# Altium schematic sheet 手环.SchDoc
size A2
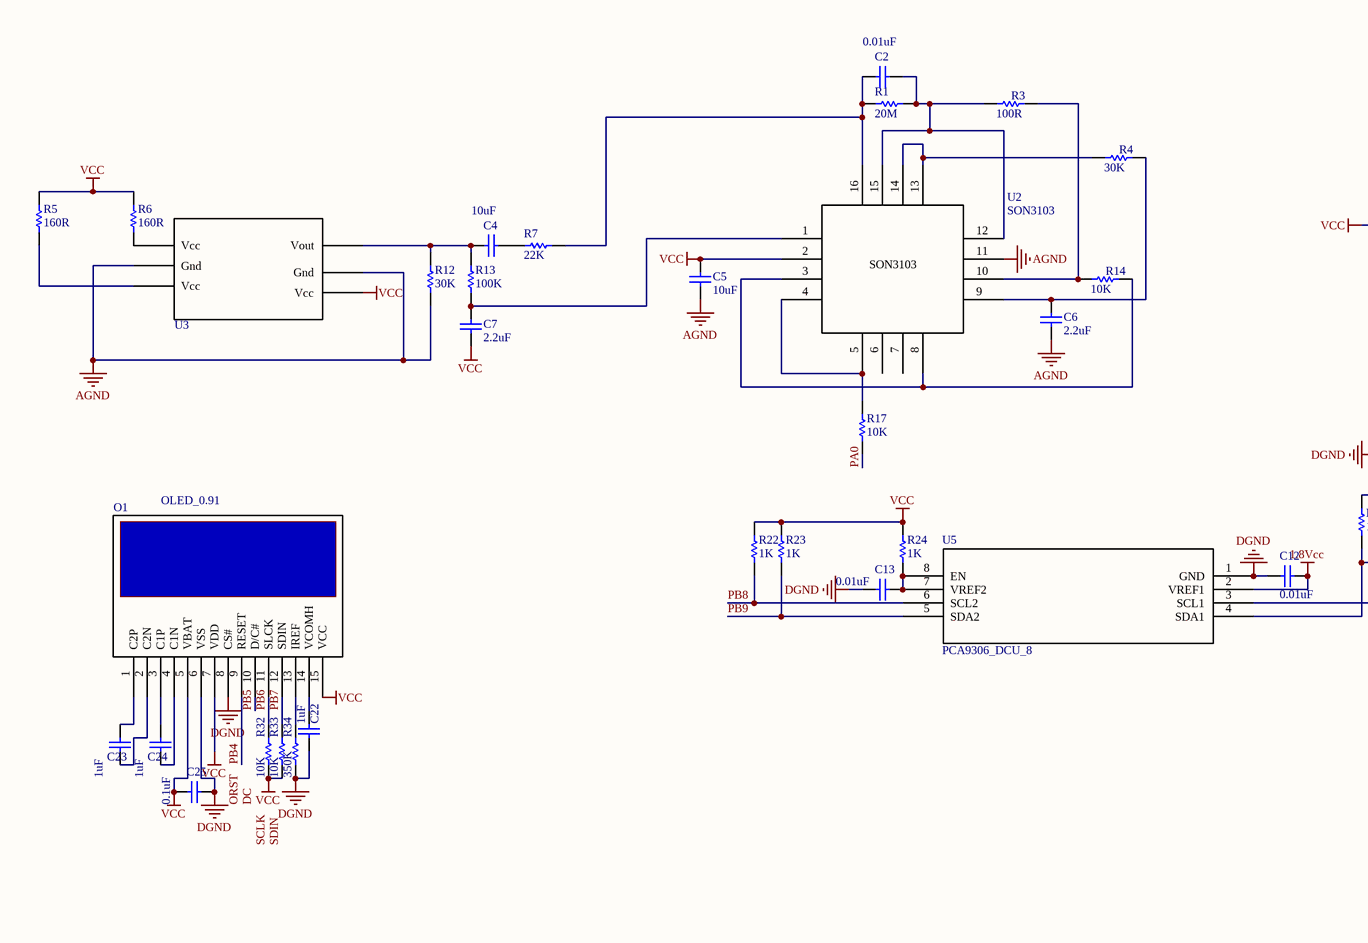
[diagram p0: 手环.SchDoc, left]
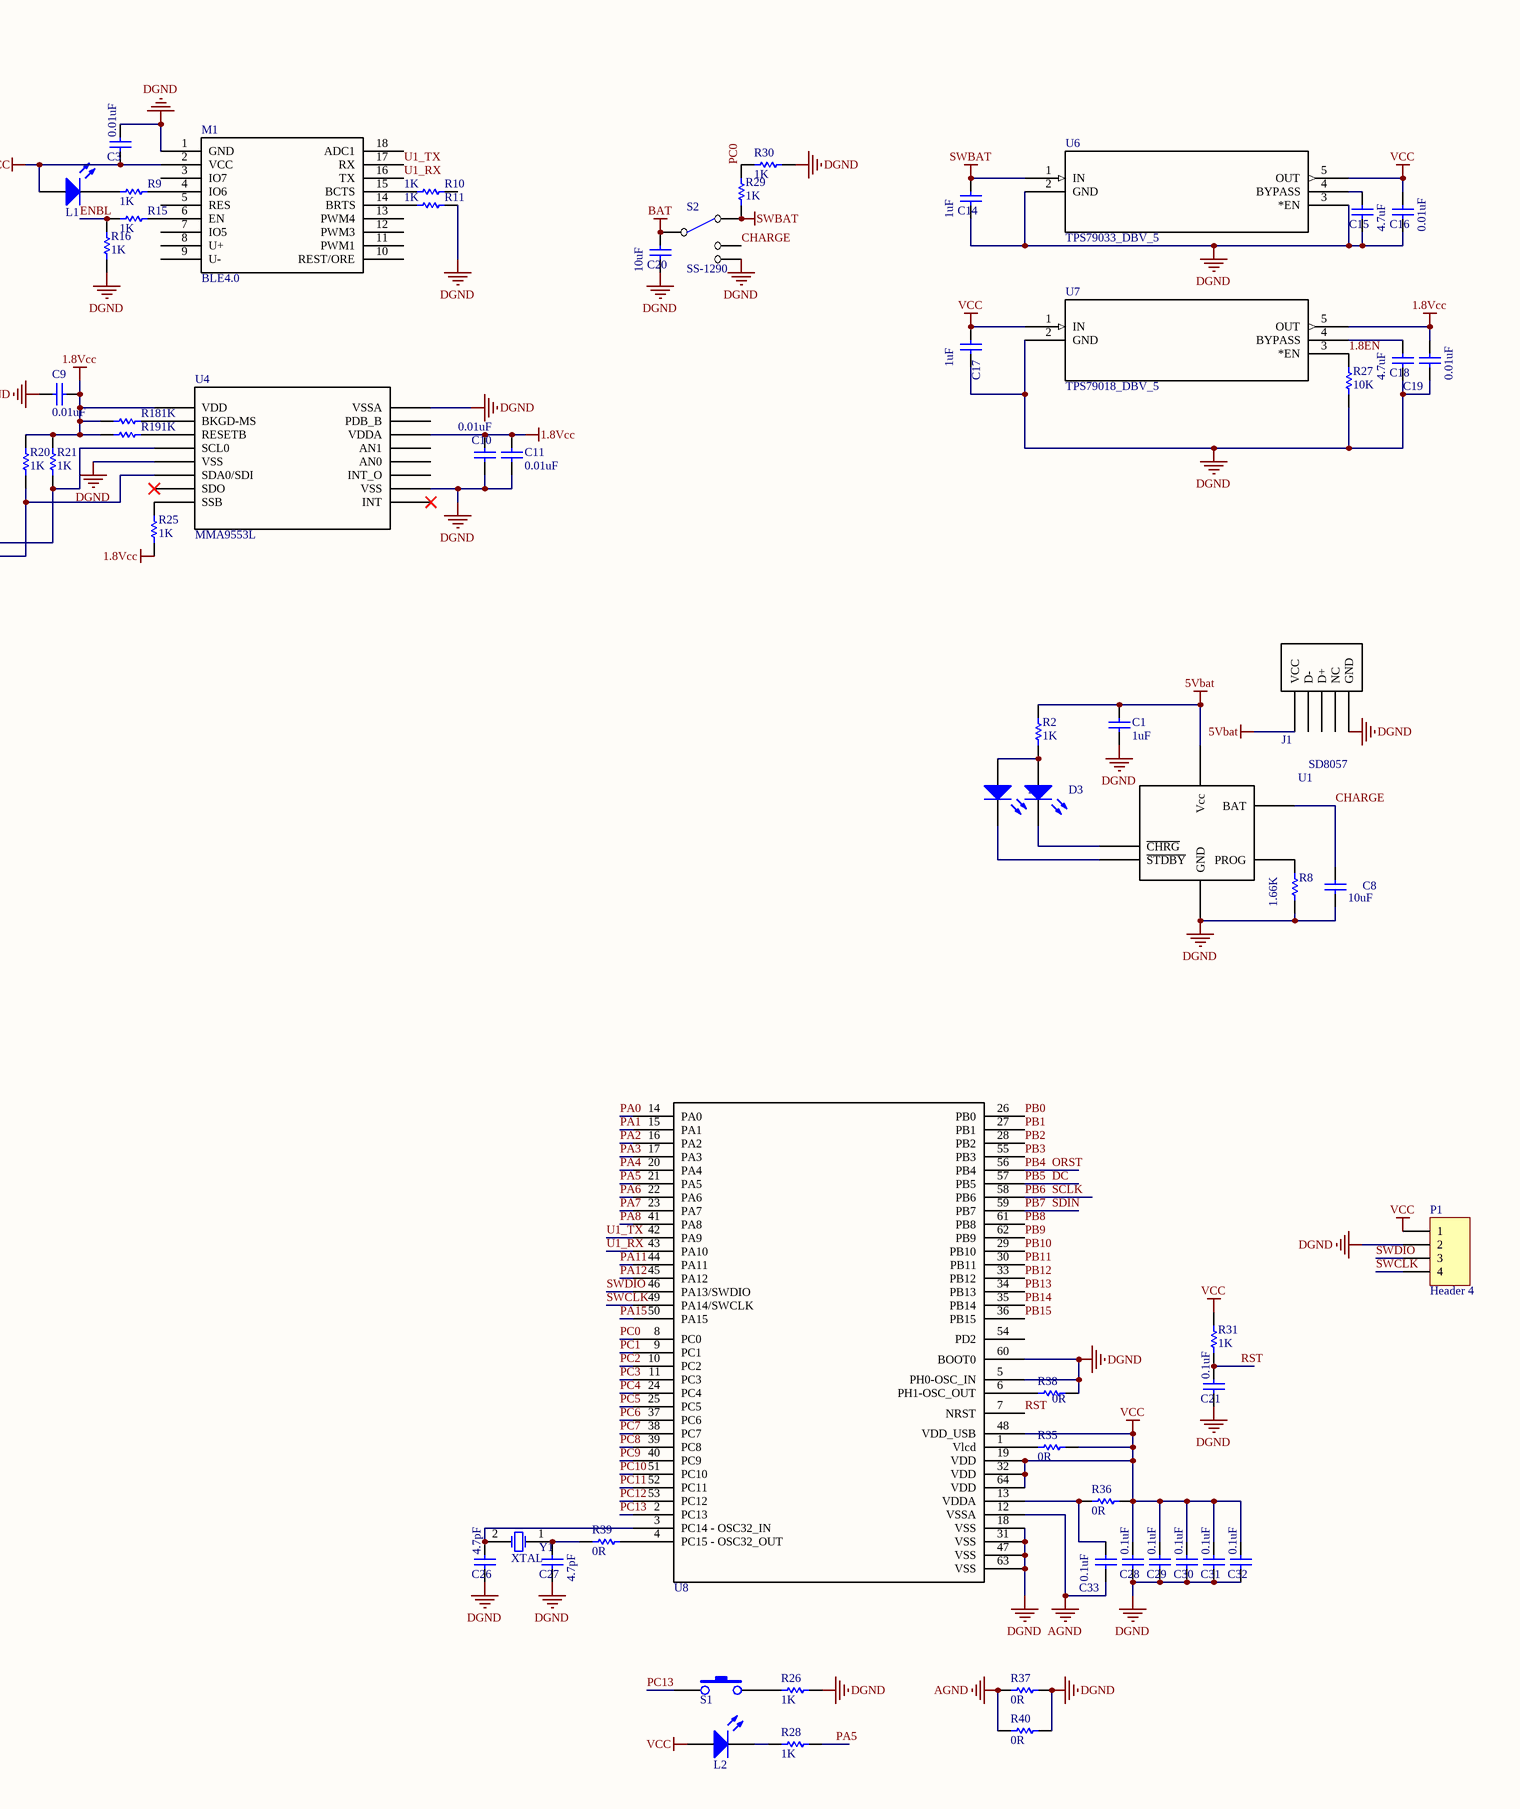
[diagram p1: 手环.SchDoc, right]

## Parts
C1  value 1uF  [0603-C-SMD]  (hidden comment: Cap)
C2  value 0.01uF  [0603-c-smd]  (hidden comment: Cap)
C3  value 0.01uF  [RAD-0.3]  (hidden comment: Cap)
C4  value 10uF  [0603-c-smd]  (hidden comment: Cap)
C5  value 10uF  [0603-c-smd]  (hidden comment: Cap)
C6  value 2.2uF  [0603-c-smd]  (hidden comment: Cap)
C7  value 2.2uF  [0603-c-smd]  (hidden comment: Cap)
C8  value 10uF  [0603-C-SMD]  (hidden comment: Cap)
C9  value 0.01uF  [RAD-0.3]  (hidden comment: Cap)
C10  value 0.01uF  [RAD-0.3]  (hidden comment: Cap)
C11  value 0.01uF  [RAD-0.3]  (hidden comment: Cap)
C12  value 0.01uF  [RAD-0.3]  (hidden comment: Cap)
C13  value 0.01uF  [RAD-0.3]  (hidden comment: Cap)
C14  value 1uF  [RAD-0.3]  (hidden comment: Cap)
C15  value 4.7uF  [RAD-0.3]  (hidden comment: Cap)
C16  value 0.01uF  [RAD-0.3]  (hidden comment: Cap)
C17  value 1uF  [RAD-0.3]  (hidden comment: Cap)
C18  value 4.7uF  [RAD-0.3]  (hidden comment: Cap)
C19  value 0.01uF  [RAD-0.3]  (hidden comment: Cap)
C20  value 10uF  [RAD-0.3]  (hidden comment: Cap)
C21  value 0.1uF  [RAD-0.3]  (hidden comment: Cap)
C22  value 1uF  [RAD-0.3]  (hidden comment: Cap)
C23  value 1uF  [RAD-0.3]  (hidden comment: Cap)
C24  value 1uF  [RAD-0.3]  (hidden comment: Cap)
C25  value 0.1uF  [RAD-0.3]  (hidden comment: Cap)
C26  value 4.7pF  [RAD-0.3]  (hidden comment: Cap)
C27  value 4.7pF  [RAD-0.3]  (hidden comment: Cap)
C28  value 0.1uF  [RAD-0.3]  (hidden comment: Cap)
C29  value 0.1uF  [RAD-0.3]  (hidden comment: Cap)
C30  value 0.1uF  [RAD-0.3]  (hidden comment: Cap)
C31  value 0.1uF  [RAD-0.3]  (hidden comment: Cap)
C32  value 0.1uF  [RAD-0.3]  (hidden comment: Cap)
C33  value 0.1uF  [RAD-0.3]  (hidden comment: Cap)
D2  LED0  [LED-0805]  (value not drawn)
D3  LED0  [LED-0805]  (value not drawn)
J1  USB  [Micro_USB]  (value not drawn)
L1  LED  [C2012]  (value not drawn)
L2  LED  [C2012]  (value not drawn)
M1  BLE4.0  [BLE4.0]
O1  OLED_0.91  [OLED_0.91]
P1  Header 4  [HDR1X4]
R1  value 20M  [R2012]  (hidden comment: Res)
R2  value 1K  [0603-R-SMD]  (hidden comment: Res)
R3  value 100R  [R2012]  (hidden comment: Res)
R4  value 30K  [R2012]  (hidden comment: Res)
R5  value 160R  [R2012]  (hidden comment: Res)
R6  value 160R  [R2012]  (hidden comment: Res)
R7  value 22K  [R2012]  (hidden comment: Res)
R8  value 1.66K  [0603-R-SMD]  (hidden comment: Res)
R9  value 1K  [R2012]  (hidden comment: Res)
R10  value 1K  [R2012]  (hidden comment: Res)
R11  value 1K  [R2012]  (hidden comment: Res)
R12  value 30K  [R2012]  (hidden comment: Res)
R13  value 100K  [R2012]  (hidden comment: Res)
R14  value 10K  [R2012]  (hidden comment: Res)
R15  value 1K  [R2012]  (hidden comment: Res)
R16  value 1K  [R2012]  (hidden comment: Res)
R17  value 10K  [R2012]  (hidden comment: Res)
R18  value 1K  [R2012]  (hidden comment: Res)
R19  value 1K  [R2012]  (hidden comment: Res)
R20  value 1K  [R2012]  (hidden comment: Res)
R21  value 1K  [R2012]  (hidden comment: Res)
R22  value 1K  [R2012]  (hidden comment: Res)
R23  value 1K  [R2012]  (hidden comment: Res)
R24  value 1K  [R2012]  (hidden comment: Res)
R25  value 1K  [R2012]  (hidden comment: Res)
R26  value 1K  [R2012]  (hidden comment: Res)
R27  value 10K  [R2012]  (hidden comment: Res)
R28  value 1K  [R2012]  (hidden comment: Res)
R29  value 1K  [R2012]  (hidden comment: Res)
R30  value 1K  [R2012]  (hidden comment: Res)
R31  value 1K  [R2012]  (hidden comment: Res)
R32  value 10K  [R2012]  (hidden comment: Res)
R33  value 10K  [R2012]  (hidden comment: Res)
R34  value 350K  [R2012]  (hidden comment: Res)
R35  value 0R  [R2012]  (hidden comment: Res)
R36  value 0R  [R2012]  (hidden comment: Res)
R37  value 0R  [R2012]  (hidden comment: Res)
R38  value 0R  [R2012]  (hidden comment: Res)
R39  value 0R  [R2012]  (hidden comment: Res)
R40  value 0R  [R2012]  (hidden comment: Res)
S1  微动开关  [贴片按键]  (value not drawn)
S2  SS-1290  [MSK-1102]
U1  SD8057  [SOT-23-6]
U2  SON3103  [TQFN-3*3-16L]
U3  SON1303  [SON1303]  (value not drawn)
U4  MMA9553L  [QFN127P600-8N]
U5  PCA9306_DCU_8  [DCT8]
U6  TPS79033_DBV_5  [DBV5]
U7  TPS79018_DBV_5  [DBV5]
U8  STM32L05xx  [QFP127P600-8N]  (value not drawn)
Y1  XTAL  [XTAL-B]

## Nets
1.8Vcc: C9.1 C10.1 C11.1 C12.1 C19.2 R18.1 R19.1 R20.2 R21.2 R25.1 U4.1(VDD) U4.14(VDDA) U5.2(VREF1) U7.5(OUT)
5Vbat: C1.2 J1.5(VCC) R2.2 U1.4(Vcc)
AGND: C5.1 C6.1 C33.1 R12.2 R37.1 R40.1 U2.11 U3.2(Gnd) U3.5(Gnd) U8.12(VSSA)
BAT: C20.2 S2.2(COMMON)
DGND: C1.1 C3.2 C8.1 C9.2 C10.2 C11.2 C12.2 C13.2 C14.1 C15.1 C16.1 C17.1 C18.1 C19.1 C20.1 C21.1 C22.1 C25.1 C26.1 C27.1 C28.1 C29.1 C30.1 C31.1 C32.1 J1.1(GND) M1.1(GND) O1.6(VSS) O1.8(CS#) P1.2 R8.1 R11.2 R16.1 R26.2 R27.2 R30.1 R34.1 R37.2 R38.2 R40.2 S2.0(G) U1.2(GND) U4.5(VSS) U4.10(VSS) U4.16(VSSA) U5.1(GND) U6.2(GND) U6.3(*EN) U7.2(GND) U8.5(PH0-OSC_IN) U8.18(VSS) U8.31(VSS) U8.47(VSS) U8.60(BOOT0) U8.63(VSS)
SWBAT: C14.2 R29.1 S2.1(NC) U6.1(IN)
VCC: C3.1 C5.2 C7.1 C16.2 C17.2 C25.2 C28.2 C29.2 C30.2 C31.2 C32.2 L1.1(A) L2.1(A) M1.2(VCC) O1.5(VBAT) O1.7(VDD) O1.15(VCC) P1.1 R5.2 R6.1 R22.2 R23.2 R24.2 R31.2 R32.1 R33.1 R35.2 R36.2 U2.2 U3.4(Vcc) U6.5(OUT) U7.1(IN) U8.19(VDD) U8.32(VDD) U8.48(VDD_USB) U8.64(VDD)
1.8EN: R27.1 U7.3(*EN)
CHARGE: C8.2 S2.3(NO) U1.3(BAT)
DC: O1.10(D/C#) U8.57(PB5)  [also labelled PB5]
ENBL: R15.1 R16.2
ORST: O1.9(RESET) U8.56(PB4)  [also labelled PB4]
PA0: R17.2 U8.14(PA0)
PA1: U8.15(PA1)
PA2: U8.16(PA2)
PA3: U8.17(PA3)
PA4: U8.20(PA4)
PA5: R28.2 U8.21(PA5)
PA6: U8.22(PA6)
PA7: U8.23(PA7)
PA8: U8.41(PA8)
PA11: U8.44(PA11)
PA12: U8.45(PA12)
PA15: U8.50(PA15)
PB0: U8.26(PB0)
PB1: U8.27(PB1)
PB2: U8.28(PB2)
PB3: U8.55(PB3)
PB6: O1.11(SLCK) R32.2 U8.58(PB6)  [also labelled SCLK]
PB7: O1.12(SDIN) R33.2 U8.59(PB7)  [also labelled SDIN]
PB8: R22.1 U5.6(SCL2) U8.61(PB8)
PB9: R23.1 U5.5(SDA2) U8.62(PB9)
PB10: U8.29(PB10)
PB11: U8.30(PB11)
PB12: U8.33(PB12)
PB13: U8.34(PB13)
PB14: U8.35(PB14)
PB15: U8.36(PB15)
PC0: R29.2 R30.2 U8.8(PC0)
PC1: U8.9(PC1)
PC2: U8.10(PC2)
PC3: U8.11(PC3)
PC4: U8.24(PC4)
PC5: U8.25(PC5)
PC6: U8.37(PC6)
PC7: U8.38(PC7)
PC8: U8.39(PC8)
PC9: U8.40(PC9)
PC10: U8.51(PC10)
PC11: U8.52(PC11)
PC12: U8.53(PC12)
PC13: S1.1 U8.2(PC13)
RST: C21.2 R31.1 U8.7(NRST)
SWCLK: P1.4 U8.49(PA14/SWCLK)
SWDIO: P1.3 U8.46(PA13/SWDIO)
U1_RX: M1.16(TX) U8.43(PA10)
U1_TX: M1.17(RX) U8.42(PA9)
NetC2_1: C2.1 R1.2 R7.2 U2.16
NetC2_2: C2.2 R1.1 R3.2 U2.12 U2.15
NetC4_1: C4.1 R12.1 R13.1 U3.6(Vout)
NetC4_2: C4.2 R7.1
NetC6_2: C6.2 R4.1 U2.9
NetC7_2: C7.2 R13.2 U2.1
NetC13_1: C13.1 R24.1 U5.7(VREF2) U5.8(EN)
NetC15_2: C15.2 U6.4(BYPASS)
NetC18_2: C18.2 U7.4(BYPASS)
NetC22_2: C22.2 O1.14(VCOMH)
NetC23_1: C23.1 O1.2(C2N)
NetC23_2: C23.2 O1.1(C2P)
NetC24_1: C24.1 O1.4(C1N)
NetC24_2: C24.2 O1.3(C1P)
NetC26_2: C26.2 U8.3(PC14_-_OSC32_IN) Y1.2(OSC2)
NetC27_2: C27.2 R39.1 Y1.1(OSC1)
NetC33_2: C33.2 R36.1 U8.13(VDDA)
NetD2_1: D2.1(A) D3.1(A) R2.1
NetD2_2: D2.2(K) U1.5(~{STDBY})
NetD3_2: D3.2(K) U1.1(~{CHRG})
NetL1_2: L1.2(K) R9.1
NetL2_2: L2.2(K) R28.1
NetM1_4: M1.4(IO6) R9.2
NetM1_6: M1.6(EN) R15.2
NetM1_14: M1.14(BRTS) R11.1
NetM1_15: M1.15(BCTS) R10.1
NetO1_13: O1.13(IREF) R34.2
NetR3_1: R3.1 R14.2 U2.10
NetR4_2: R4.2 U2.13 U2.14
NetR5_1: R5.1 U3.3(Vcc)
NetR6_2: R6.2 U3.1(Vcc)
NetR8_2: R8.2 U1.6(PROG)
NetR14_1: R14.1 U2.3 U2.8
NetR17_1: R17.1 U2.4 U2.5
NetR18_2: R18.2 U4.2(BKGD-MS)
NetR19_2: R19.2 U4.3(RESETB)
NetR20_1: R20.1 U4.6(SDA0/SDI) U5.4(SDA1)
NetR21_1: R21.1 U4.4(SCL0) U5.3(SCL1)
NetR25_2: R25.2 U4.8(SSB)
NetR26_1: R26.1 S1.2
NetR35_1: R35.1 U8.1(Vlcd)
NetR38_1: R38.1 U8.6(PH1-OSC_OUT)
NetR39_2: R39.2 U8.4(PC15_-_OSC32_OUT)

Not connected (* = marked no-connect by the designer): J1 2(NC) 3(D+) 4(D-); M1 3(IO7) 5(RES) 7(IO5) 8(U+) 9(U-) 10(REST/ORE) 11(PWM1) 12(PWM3) 13(PWM4) 18(ADC1); R10 2; U2 6 7; U4 7(SDO)* 9(INT)* 11(INT_O) 12(AN0) 13(AN1) 15(PDB_B); U8 54(PD2)

## Notes on the sheet
- Labels drawn without touching a wire or pin: DC, ORST, SCLK, SDIN

## Library data of the parts
C1-C33 = Cap: Capacitor; Published: 8-Jun-2000; LatestRevisionDate: 17-Jul-2002; LatestRevisionNote: Re-released for DXP Platform.; PackageReference: RAD-0.3; Publisher: Altium Limited
D2 D3 = LED0: Typical INFRARED GaAs LED; Published: 8-Jun-2000; LatestRevisionDate: 08-Jul-2005; LatestRevisionNote: Mech Layer 1 removed.; PackageReference: LED-0; Publisher: Altium Limited
J1 = micro usb
M1 = BLE4.0模块
O1 = OLED-0.91
P1 = Header 4: Header, 4-Pin; LatestRevisionDate: 17-Jul-2002; LatestRevisionNote: Re-released for DXP Platform.; Publisher: Altium Limited
R1-R40 = Res: 贴片电阻; Published: 8-Jun-2000; LatestRevisionDate: 17-Jul-2002; LatestRevisionNote: Re-released for DXP Platform.; PackageReference: AXIAL-0.3; Publisher: Altium Limited
U5 = PCA9306_DCU_8: Imported; Manufacturer: Texas Instruments; INDUSTRY_STD_PKG_TYPE: US8; FAMILY_NAME: I2C SPECIAL FUNCTION; PIN_COUNT: 8; PACKAGE_DESIGNATOR: DCU; Datasheet URL: http://www.ti.com/lit/gpn/PCA9306; GENERIC_PART_NUMBER: PCA9306; Vendor: Texas Instruments; Manufacturer_Part_Number: pca9306_dcu_8; RefDes: RefDes; Type: DEV; Value: Value
U6 U7 = TPS79018_DBV_5: Imported; Vendor: Texas Instruments; PACKAGE_DESIGNATOR: DBV; PIN_COUNT: 5; FAMILY_NAME: SINGLE CHANNEL LDO; INDUSTRY_STD_PKG_TYPE: SOT-23; Manufacturer_Part_Number: tps79018_dbv_5; GENERIC_PART_NUMBER: TPS79018; Datasheet URL: http://www.ti.com/lit/gpn/TPS79018; Manufacturer: Texas Instruments; RefDes: RefDes; Type: DEV; Value: Value
Y1 = XTAL: 晶体振荡器; Published: 8-Jun-2000; LatestRevisionDate: 17-Jul-2002; LatestRevisionNote: Re-released for DXP Platform.; PackageReference: R38; Publisher: Altium Limited